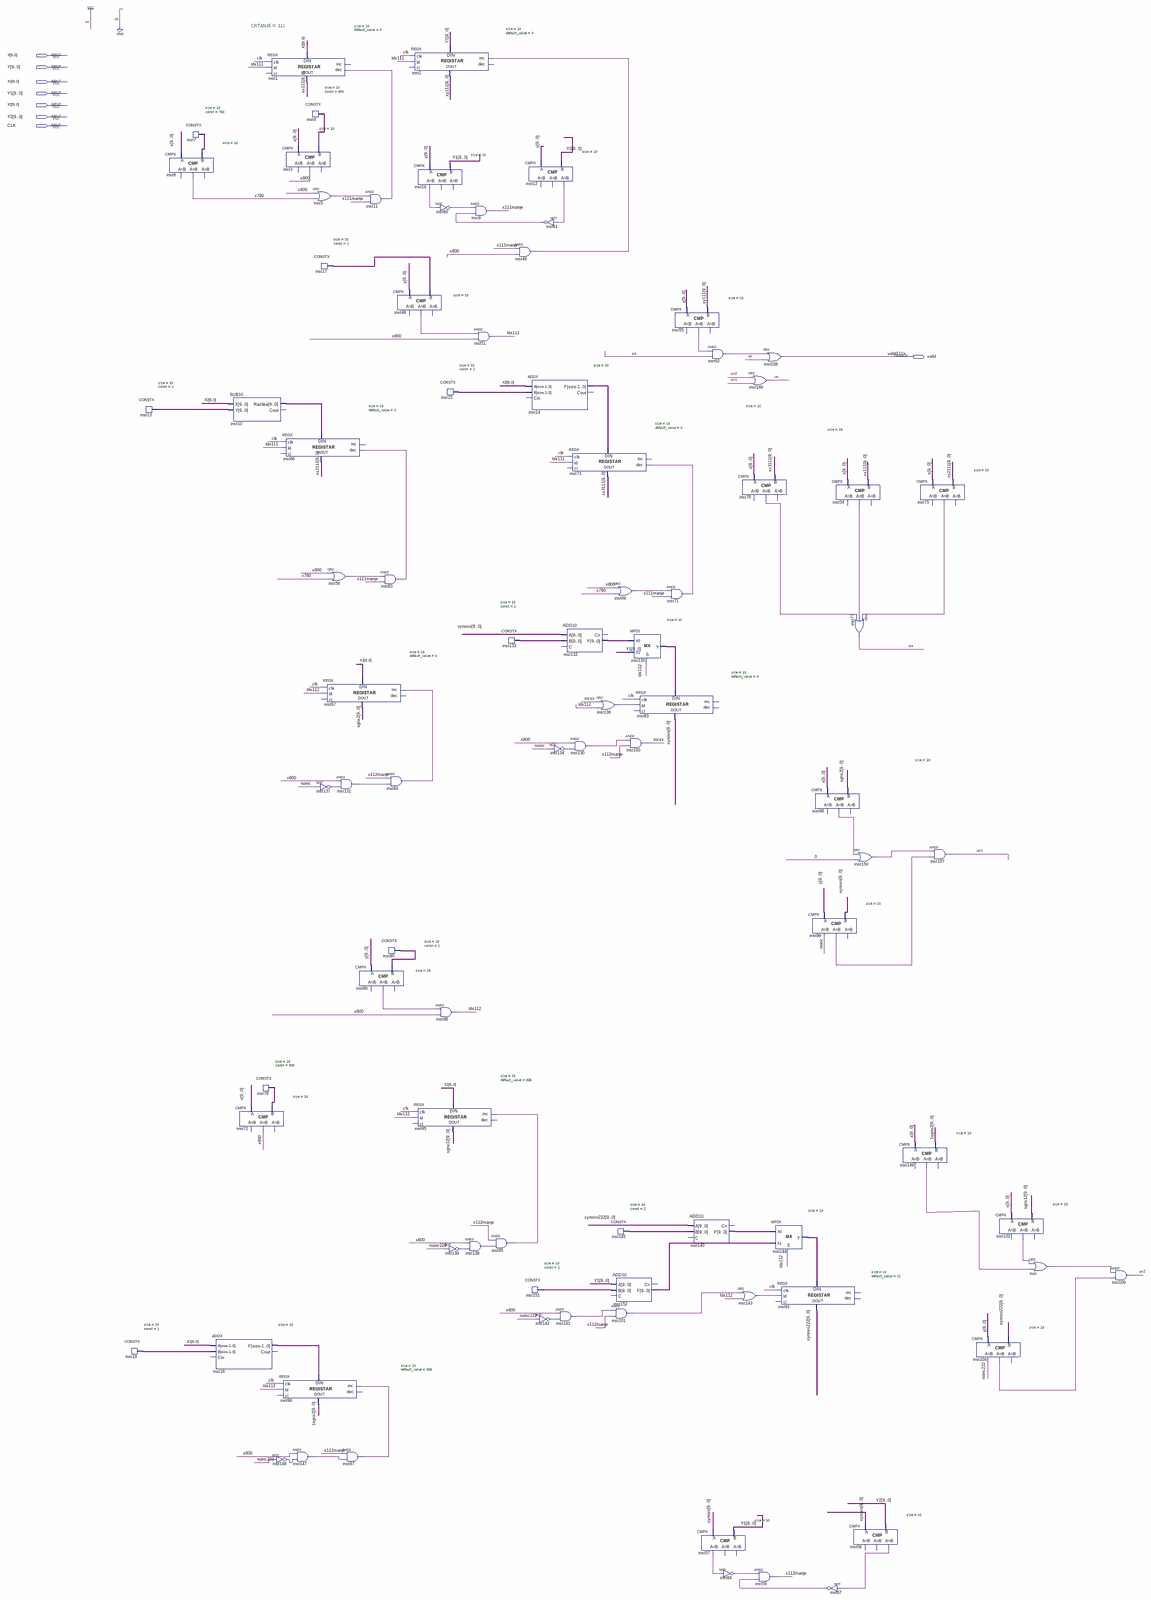
[diagram p0: schematic sheet, whole]
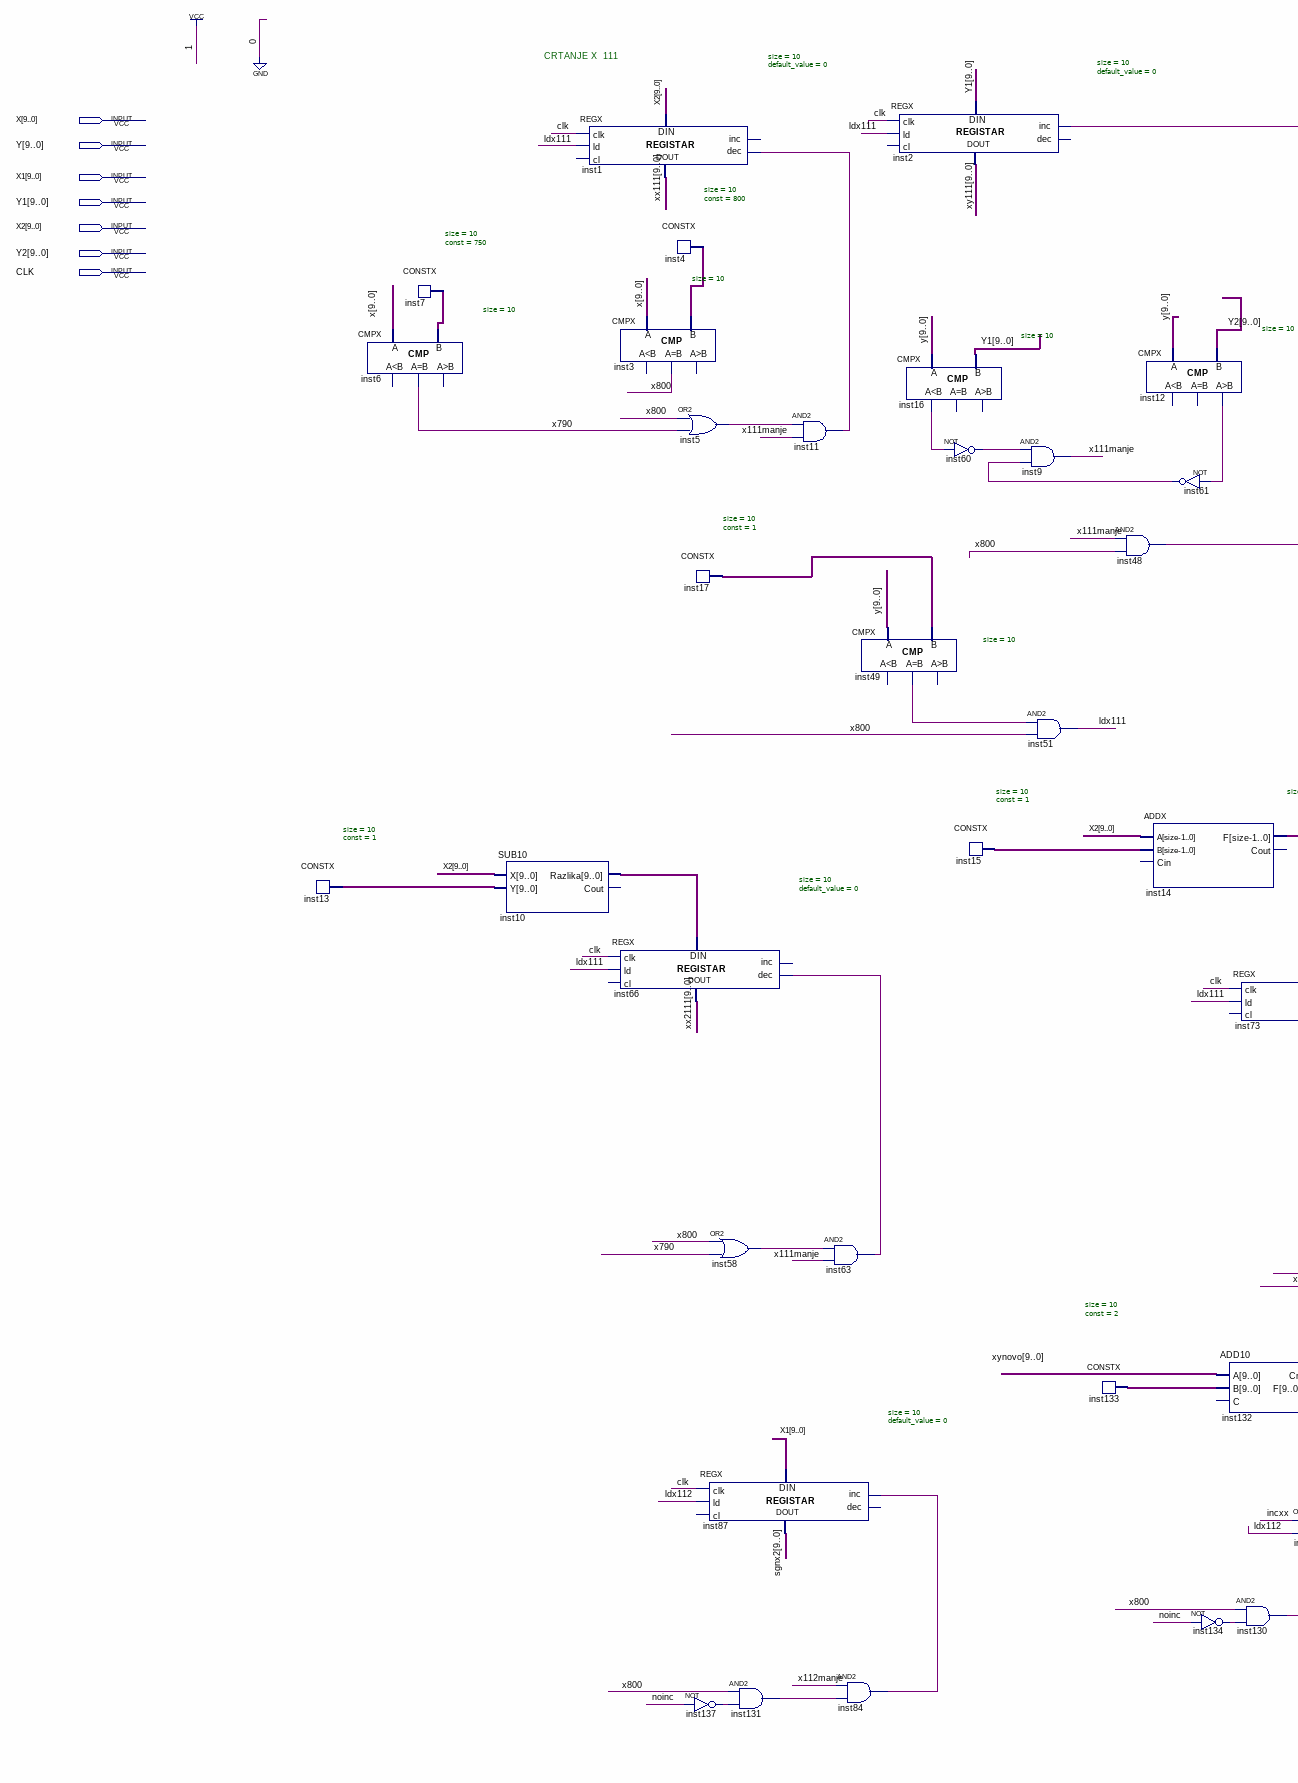
[diagram p1: schematic sheet, upper left part]
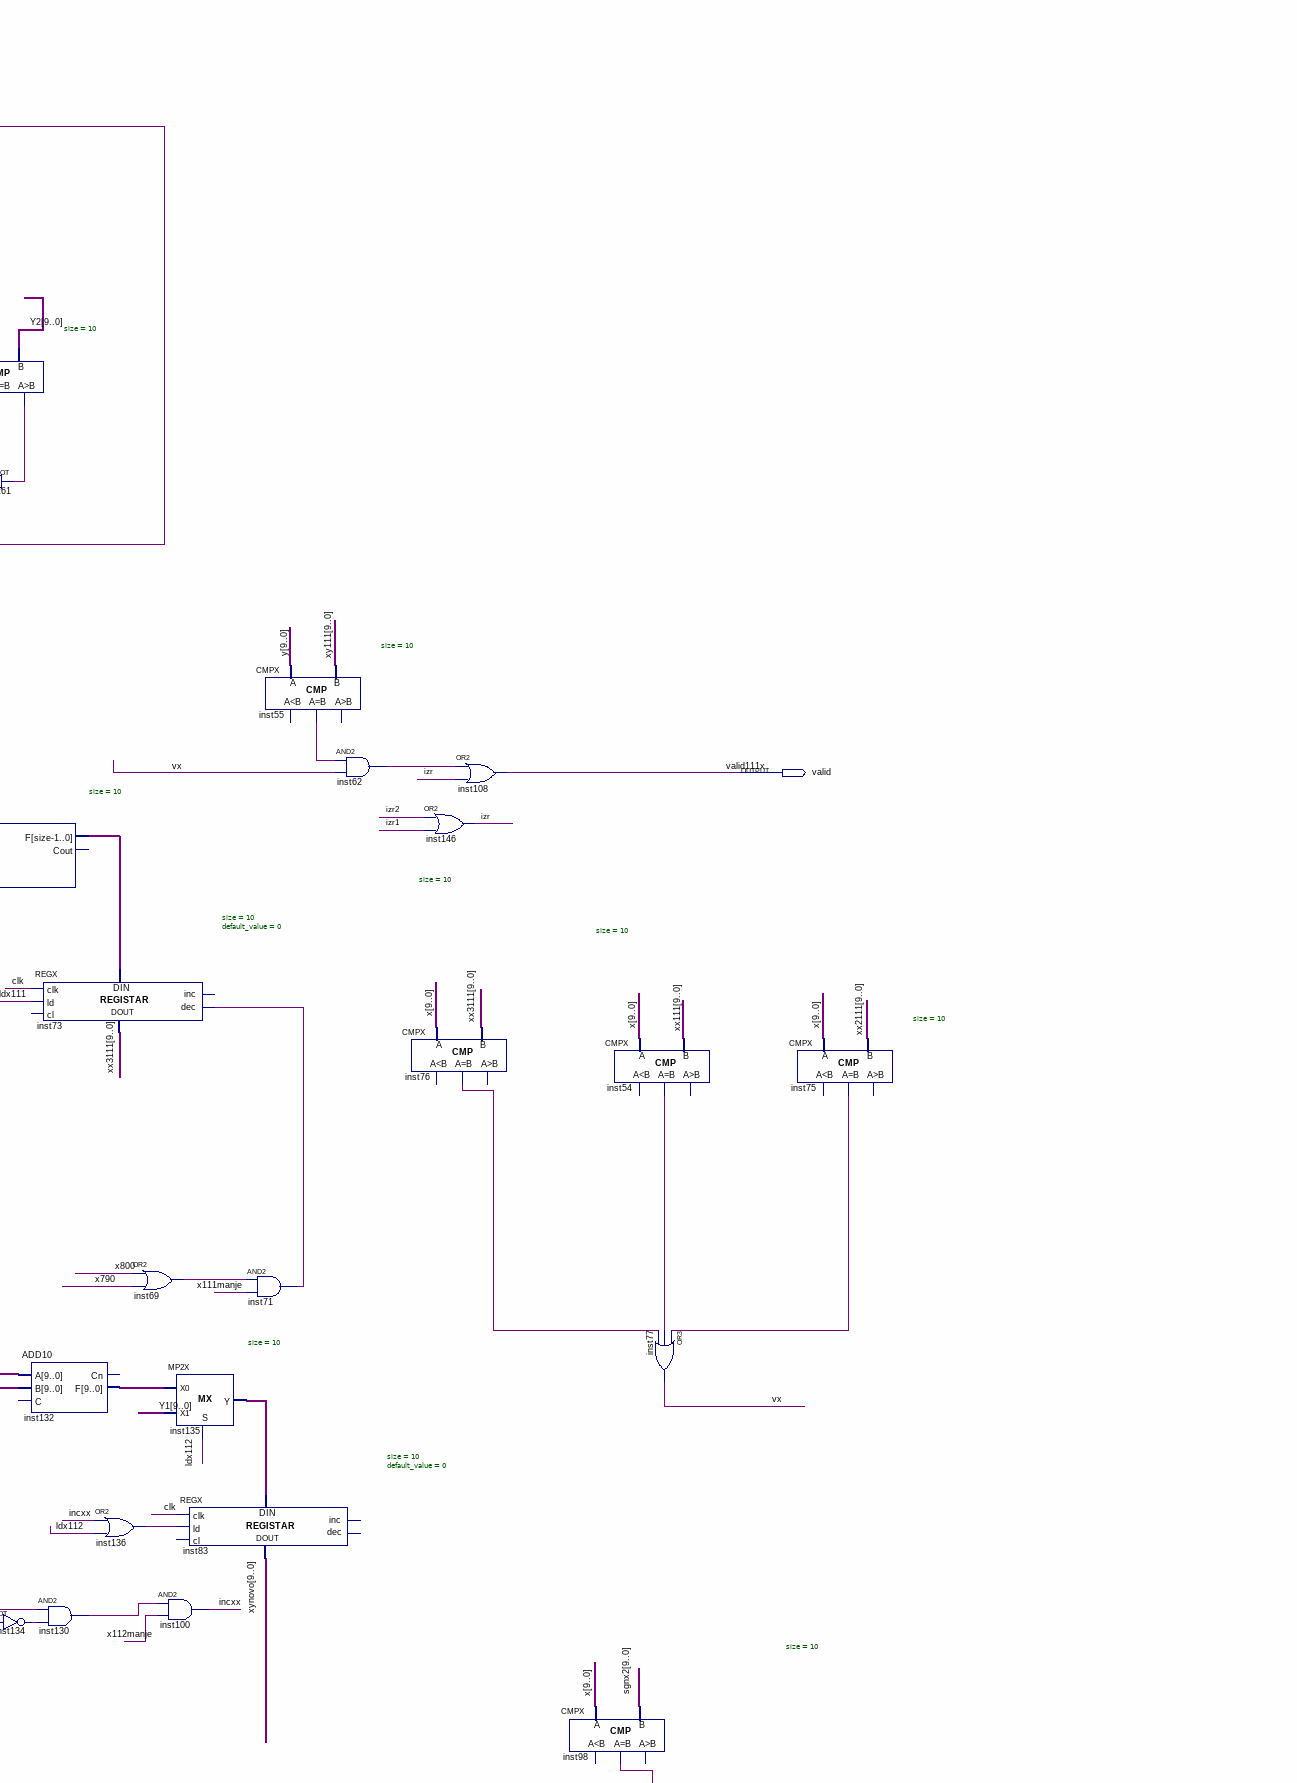
[diagram p2: schematic sheet, upper right part]
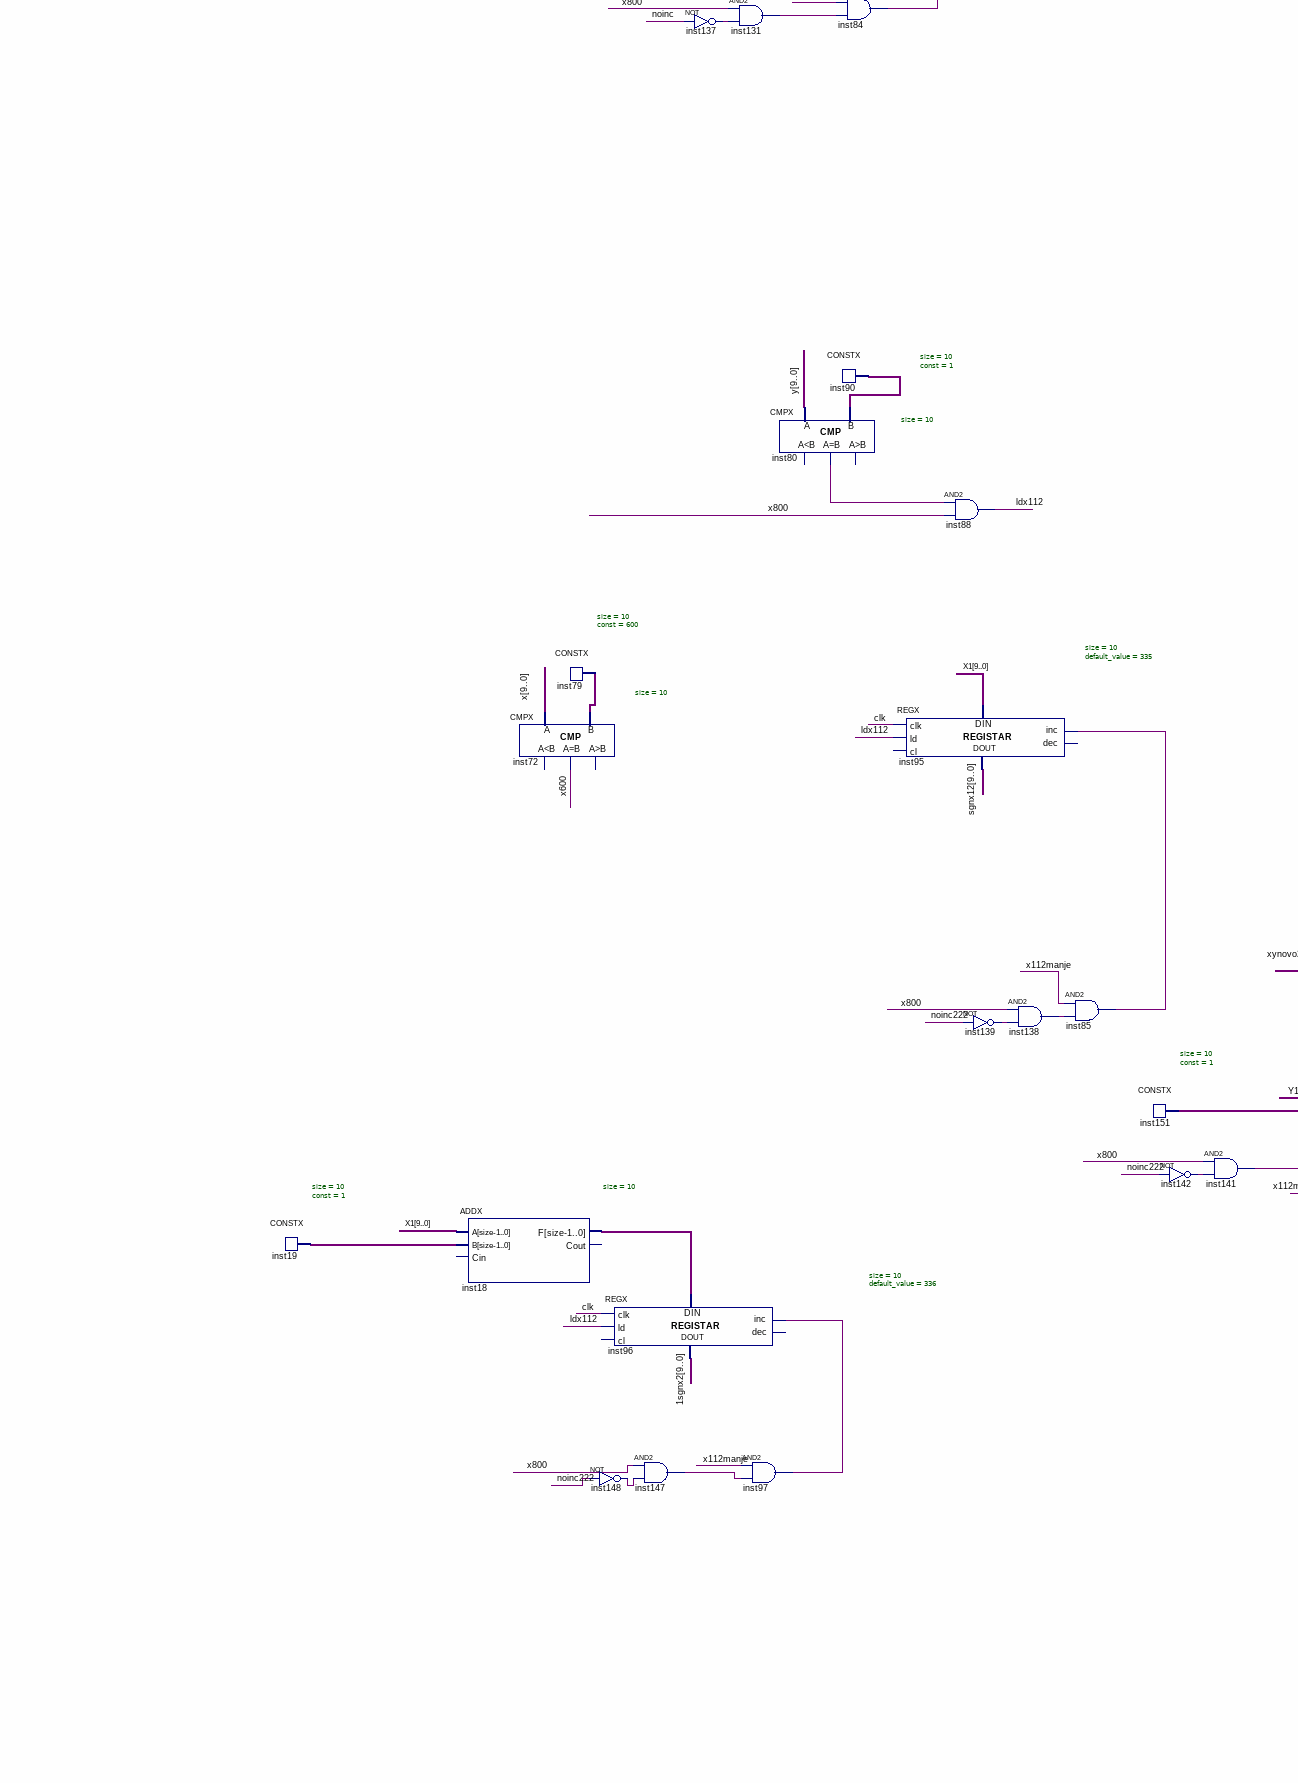
[diagram p3: schematic sheet, lower left part]
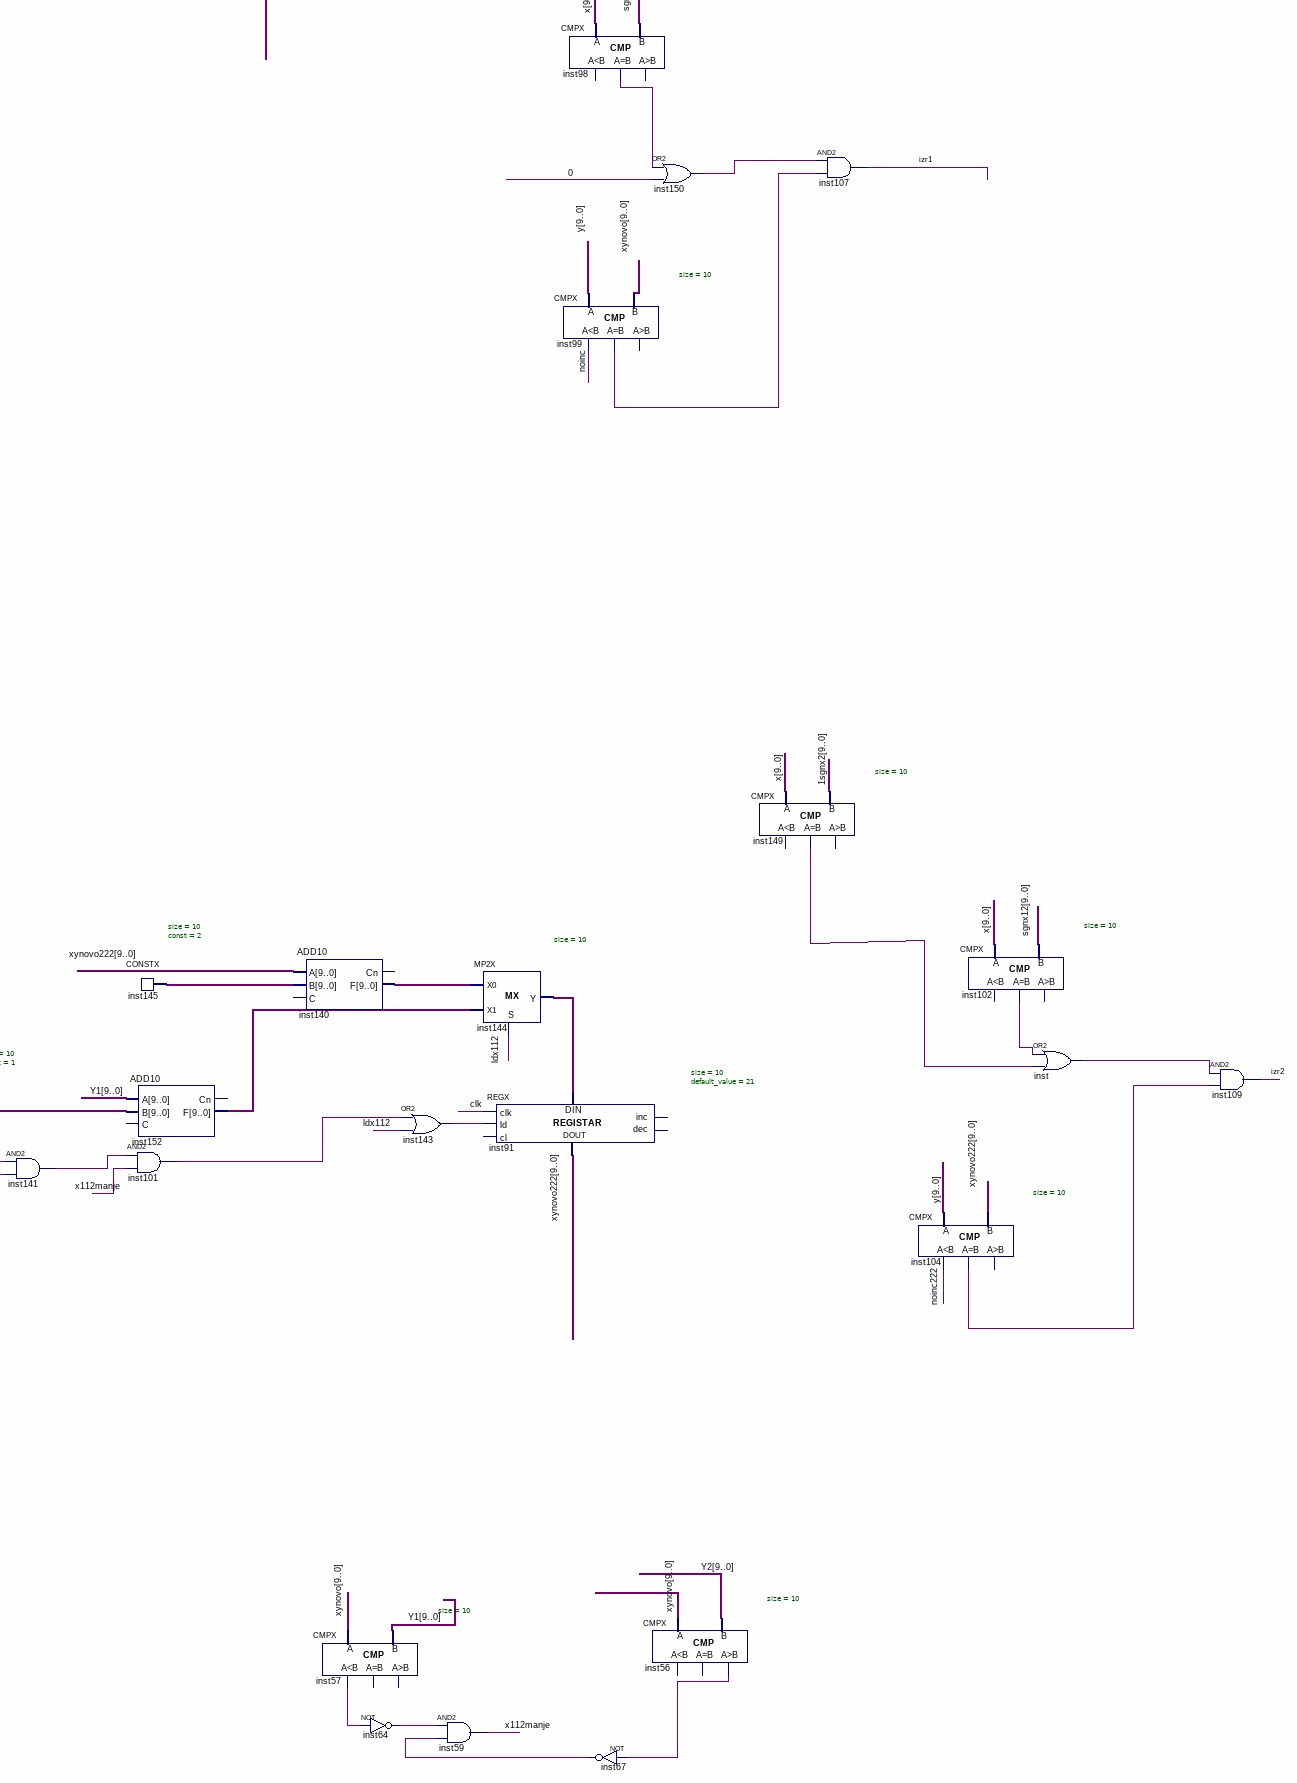
[diagram p4: schematic sheet, lower right part]
// Quartus schematic Xcrtanje.bdf as structural Verilog: 86 symbols, 8 pins
module Xcrtanje (
  input  [9:0] X,
  input  [9:0] Y,
  input  [9:0] X1,
  input  [9:0] Y1,
  input  [9:0] X2,
  input  [9:0] Y2,
  input  CLK,
  output valid
);

  wire incxx, inst5_out, inst11_out, inst12_gr, inst16_ls, inst48_out, inst49_eq, inst54_eq, inst55_eq,
       inst56_gr, inst57_ls, inst58_out, inst60_out, inst61_out, inst62_out, inst63_out, inst64_out,
       inst67_out, inst69_out, inst71_out, inst75_eq, inst76_eq, inst80_eq, inst84_out, inst85_out,
       inst97_out, inst98_eq, inst99_eq, inst101_out, inst102_eq, inst104_eq, inst130_out, inst131_out,
       inst134_out, inst136_out, inst137_out, inst138_out, inst139_out, inst141_out, inst142_out,
       inst143_out, inst147_out, inst148_out, inst149_eq, inst150_out, inst_out, izr, izr1, izr2, ldx111,
       ldx112, noinc, noinc222, vx, x111manje, x112manje, x600, x790, x800;
  wire [9:0] \1sgnx2 , inst4_data, inst7_data, inst10_razlika, inst13_data, inst14_f, inst15_data,
       inst17_data, inst18_f, inst19_data, inst79_data, inst90_data, inst132_f, inst133_data, inst135_y,
       inst140_f, inst144_y, inst145_data, inst151_data, inst152_f, sgnx2, sgnx12, xx111, xx2111, xx3111,
       xy111, xynovo, xynovo222;

  CONSTX #(.size(10), .\const (1)) inst19 (.data(inst19_data));
  CONSTX #(.size(10), .\const (1)) inst13 (.data(inst13_data));
  CMPX #(.size(10)) inst6 (.A(X), .B(inst7_data), .eq(x790));  // open: ls, gr
  CONSTX #(.size(10), .\const (750)) inst7 (.data(inst7_data));
  ADDX #(.size(10)) inst18 (.A(X1), .B(inst19_data), .F(inst18_f));  // open: Cin, Cout
  SUB10 inst10 (.X(X2), .Y(inst13_data), .Razlika(inst10_razlika));  // open: Cout
  CMPX #(.size(10)) inst72 (.A(X), .B(inst79_data), .eq(x600));  // open: ls, gr
  CONSTX #(.size(10), .\const (600)) inst79 (.data(inst79_data));
  REGX #(.size(10), .default_value(0)) inst1 (
    .clk(CLK), .ld(ldx111), .dec(inst11_out), .data_in(X2), .data_out(xx111));  // open: cl, inc
  CMPX #(.size(10)) inst3 (.A(X), .B(inst4_data), .eq(x800));  // open: ls, gr
  REGX #(.size(10), .default_value(0)) inst66 (
    .clk(CLK), .ld(ldx111), .dec(inst63_out), .data_in(inst10_razlika), .data_out(xx2111));  // open: cl, inc
  REGX #(.size(10), .default_value(336)) inst96 (
    .clk(CLK), .ld(ldx112), .inc(inst97_out), .data_in(inst18_f), .data_out(\1sgnx2 ));  // open: cl, dec
  not inst148 (inst148_out, noinc222);
  CONSTX #(.size(10), .\const (800)) inst4 (.data(inst4_data));
  and inst147 (inst147_out, x800, inst148_out);
  or inst5 (inst5_out, x800, x790);
  CONSTX #(.size(10), .\const (1)) inst17 (.data(inst17_data));
  or inst58 (inst58_out, x800, x790);
  REGX #(.size(10), .default_value(0)) inst87 (
    .clk(CLK), .ld(ldx112), .inc(inst84_out), .data_in(X1), .data_out(sgnx2));  // open: cl, dec
  not inst137 (inst137_out, noinc);
  and inst131 (inst131_out, x800, inst137_out);
  CMPX #(.size(10)) inst80 (.A(Y), .B(inst90_data), .eq(inst80_eq));  // open: ls, gr
  and inst97 (inst97_out, x112manje, inst147_out);
  and inst11 (inst11_out, inst5_out, x111manje);
  and inst63 (inst63_out, inst58_out, x111manje);
  CONSTX #(.size(10), .\const (1)) inst90 (.data(inst90_data));
  CMPX #(.size(10)) inst49 (.A(Y), .B(inst17_data), .eq(inst49_eq));  // open: ls, gr
  and inst84 (inst84_out, x112manje, inst131_out);
  REGX #(.size(10), .default_value(0)) inst2 (
    .clk(CLK), .ld(ldx111), .inc(inst48_out), .data_in(Y1), .data_out(xy111));  // open: cl, dec
  CMPX #(.size(10)) inst16 (.A(Y), .B(Y1), .ls(inst16_ls));  // open: eq, gr
  REGX #(.size(10), .default_value(335)) inst95 (
    .clk(CLK), .ld(ldx112), .inc(inst85_out), .data_in(X1), .data_out(sgnx12));  // open: cl, dec
  not inst60 (inst60_out, inst16_ls);
  CONSTX #(.size(10), .\const (1)) inst15 (.data(inst15_data));
  and inst88 (ldx112, inst80_eq, x800);
  not inst139 (inst139_out, noinc222);
  and inst9 (x111manje, inst60_out, inst61_out);
  and inst51 (ldx111, inst49_eq, x800);
  and inst138 (inst138_out, x800, inst139_out);
  and inst85 (inst85_out, x112manje, inst138_out);
  and inst48 (inst48_out, x111manje, x800);
  CONSTX #(.size(10), .\const (2)) inst133 (.data(inst133_data));
  CMPX #(.size(10)) inst12 (.A(Y), .B(Y2), .gr(inst12_gr));  // open: ls, eq
  not inst61 (inst61_out, inst12_gr);
  ADDX #(.size(10)) inst14 (.A(X2), .B(inst15_data), .F(inst14_f));  // open: Cin, Cout
  CONSTX #(.size(10), .\const (1)) inst151 (.data(inst151_data));
  not inst142 (inst142_out, noinc222);
  REGX #(.size(10), .default_value(0)) inst73 (
    .clk(CLK), .ld(ldx111), .dec(inst71_out), .data_in(inst14_f), .data_out(xx3111));  // open: cl, inc
  ADD10 inst132 (.A(xynovo), .B(inst133_data), .F(inst132_f));  // open: C, Cn
  not inst134 (inst134_out, noinc);
  and inst141 (inst141_out, x800, inst142_out);
  and inst130 (inst130_out, x800, inst134_out);
  or inst69 (inst69_out, x800, x790);
  or inst136 (inst136_out, incxx, ldx112);
  CONSTX #(.size(10), .\const (2)) inst145 (.data(inst145_data));
  ADD10 inst152 (.A(Y1), .B(inst151_data), .F(inst152_f));  // open: C, Cn
  and inst101 (inst101_out, inst141_out, x112manje);
  MP2X #(.size(10)) inst135 (.S(ldx112), .X0(inst132_f), .X1(Y1), .Y(inst135_y));
  REGX #(.size(10), .default_value(0)) inst83 (
    .clk(CLK), .ld(inst136_out), .data_in(inst135_y), .data_out(xynovo));  // open: cl, inc, dec
  and inst100 (incxx, inst130_out, x112manje);
  CMPX #(.size(10)) inst55 (.A(Y), .B(xy111), .eq(inst55_eq));  // open: ls, gr
  and inst71 (inst71_out, inst69_out, x111manje);
  and inst62 (inst62_out, inst55_eq, vx);
  ADD10 inst140 (.A(xynovo222), .B(inst145_data), .F(inst140_f));  // open: C, Cn
  CMPX #(.size(10)) inst57 (.A(xynovo), .B(Y1), .ls(inst57_ls));  // open: eq, gr
  not inst64 (inst64_out, inst57_ls);
  or inst146 (izr, izr2, izr1);
  CMPX #(.size(10)) inst76 (.A(X), .B(xx3111), .eq(inst76_eq));  // open: ls, gr
  or inst143 (inst143_out, inst101_out, ldx112);
  and inst59 (x112manje, inst64_out, inst67_out);
  or inst108 (valid, inst62_out, izr);
  MP2X #(.size(10)) inst144 (.S(ldx112), .X0(inst140_f), .X1(inst152_f), .Y(inst144_y));
  REGX #(.size(10), .default_value(21)) inst91 (
    .clk(CLK), .ld(inst143_out), .data_in(inst144_y), .data_out(xynovo222));  // open: cl, inc, dec
  CMPX #(.size(10)) inst98 (.A(X), .B(sgnx2), .eq(inst98_eq));  // open: ls, gr
  CMPX #(.size(10)) inst99 (.A(Y), .B(xynovo), .ls(noinc), .eq(inst99_eq));  // open: gr
  not inst67 (inst67_out, inst56_gr);
  CMPX #(.size(10)) inst54 (.A(X), .B(xx111), .eq(inst54_eq));  // open: ls, gr
  CMPX #(.size(10)) inst56 (.A(xynovo), .B(Y2), .gr(inst56_gr));  // open: ls, eq
  or inst77 (vx, inst75_eq, inst54_eq, inst76_eq);
  or inst150 (inst150_out, inst98_eq, 1'b0);
  CMPX #(.size(10)) inst75 (.A(X), .B(xx2111), .eq(inst75_eq));  // open: ls, gr
  CMPX #(.size(10)) inst149 (.A(X), .B(\1sgnx2 ), .eq(inst149_eq));  // open: ls, gr
  and inst107 (izr1, inst150_out, inst99_eq);
  CMPX #(.size(10)) inst104 (.A(Y), .B(xynovo222), .ls(noinc222), .eq(inst104_eq));  // open: gr
  CMPX #(.size(10)) inst102 (.A(X), .B(sgnx12), .eq(inst102_eq));  // open: ls, gr
  or inst (inst_out, inst102_eq, inst149_eq);
  and inst109 (izr2, inst_out, inst104_eq);

  // Other names for the same wires on the sheet: valid111x = valid

  // Notes on the sheet:
  //   CRTANJE X  111          
endmodule
